# EAGLE design xyzxyz (EAGLE 9.0.1)
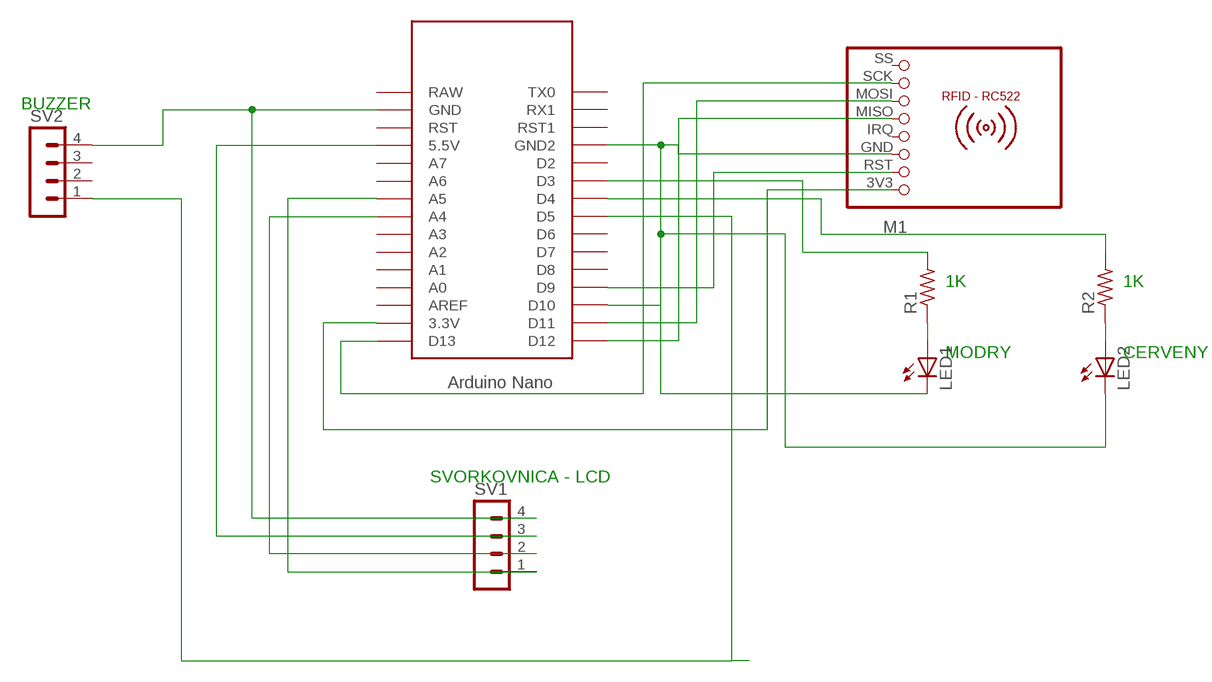
[diagram p0: schematic, sheet 1]

## Parts
LED1  LED3MM  [LED3MM]
LED2  LED3MM  [LED3MM]
M1  RFID-RC522  [RFID-RC522]
R1  R-US_0414/15  [0414/15]
R2  R-US_0414/15  [0414/15]
SV1  MA04-1  [MA04-1]
SV2  MA04-1  [MA04-1]
U$1  NANO  [NANO]

## Nets
N$1: M1.3V3 U$1.3.3V
N$2: LED1.K(C) LED2.K(C) M1.GND U$1.GND1(GND2)
N$3: M1.RST U$1.D9
N$4: M1.MISO U$1.D12
N$5: M1.MOSI U$1.D11
N$6: M1.SCK U$1.D13
N$7: U$1.D10
N$8: SV1.4 SV2.4 U$1.GND
N$9: SV1.3 U$1.5V(5.5V)
N$10: SV1.2 U$1.A4
N$11: SV1.1 U$1.A5
N$13: LED1.A R1.1
N$14: LED2.A R2.1
N$15: R1.2 U$1.D3
N$16: R2.2 U$1.D4
N$18: SV2.1 U$1.D5
Unconnected: M1.IRQ M1.SS SV2.2 SV2.3 U$1.A0 U$1.A1 U$1.A2 U$1.A3 U$1.A6 U$1.A7 U$1.AREF U$1.D2 U$1.D6 U$1.D7 U$1.D8 U$1.ICSP1 U$1.ICSP2 U$1.ICSP3 U$1.ICSP4 U$1.ICSP5 U$1.ICSP6 U$1.RAW U$1.RST U$1.RST1 U$1.RX1 U$1.TX0

## Notes on the sheet
- BUZZER
- 1K | 1K
- MODRY | CERVENY
- SVORKOVNICA - LCD

## Library data of the parts
LED1 LED2 = adafruit:LED: LED OSRAM: - CHIPLED LG R971, LG N971, LY N971, LG Q971, LY Q971, LO R971, LY R971 LH N974, LH R974 LS Q976, LO Q976, LY Q976 LO Q996 - Hyper CHIPLED LW Q18S LB Q993, LB Q99A, LB R99A - SideLED LS A670, LO A670, LY A670, LG A670, LP A670 LB A673, LV A673, LT A673, LW A673 LH A674 LY A675 LS A676, LA A676, LO A676, LY A676, LW A676 LS A679, LY A679, LG A679 - Hyper Micro SIDELED® LS Y876, LA Y876, LO Y876, LY Y876 LT Y87S - SmartLED LW L88C, LW L88S LB L89C, LB L89S, LG L890 LS L89K, LO L89K, LY L89K LS L896, LA L896, LO L896, LY L896 - TOPLED LS T670, LO T670, LY T670, LG T670, LP T670 LSG T670, LSP T670, LSY T670, LOP T670, LYG T670 LG T671, LOG T671, LSG T671 LB T673, LV T673, LT T673, LW T673 LH T674 LS T676, LA T676, LO T676, LY T676, LB T676, LH T676, LSB T676, LW T676 LB T67C, LV T67C, LT T67C, LS T67K, LO T67K, LY T67K, LW E67C LS E67B, LA E67B, LO E67B, LY E67B, LB E67C, LV E67C, LT E67C LW T67C LS T679, LY T679, LG T679 LS T770, LO T770, LY T770, LG T770, LP T770 LB T773, LV T773, LT T773, LW T773 LH T774 LS E675, LA E675, LY E675, LS T675 LS T776, LA T776, LO T776, LY T776, LB T776 LHGB T686 LT T68C, LB T68C - Hyper Mini TOPLED® LB M676 - Mini TOPLED Santana® LG M470 LS M47K, LO M47K, LY M47K Source: http://www.osram.convergy.de/
M1 = mfrc522-module:RFID-RC522: RFID-RC522 MFRC-522 based breakout board
R1 R2 = adafruit:R-US_: RESISTOR, American symbol
SV1 SV2 = con-lstb:MA04-1: PIN HEADER; OC_FARNELL: unknown; OC_NEWARK: unknown
U$1 = Arduino-clone:NANO: Arduino Nano

## Board
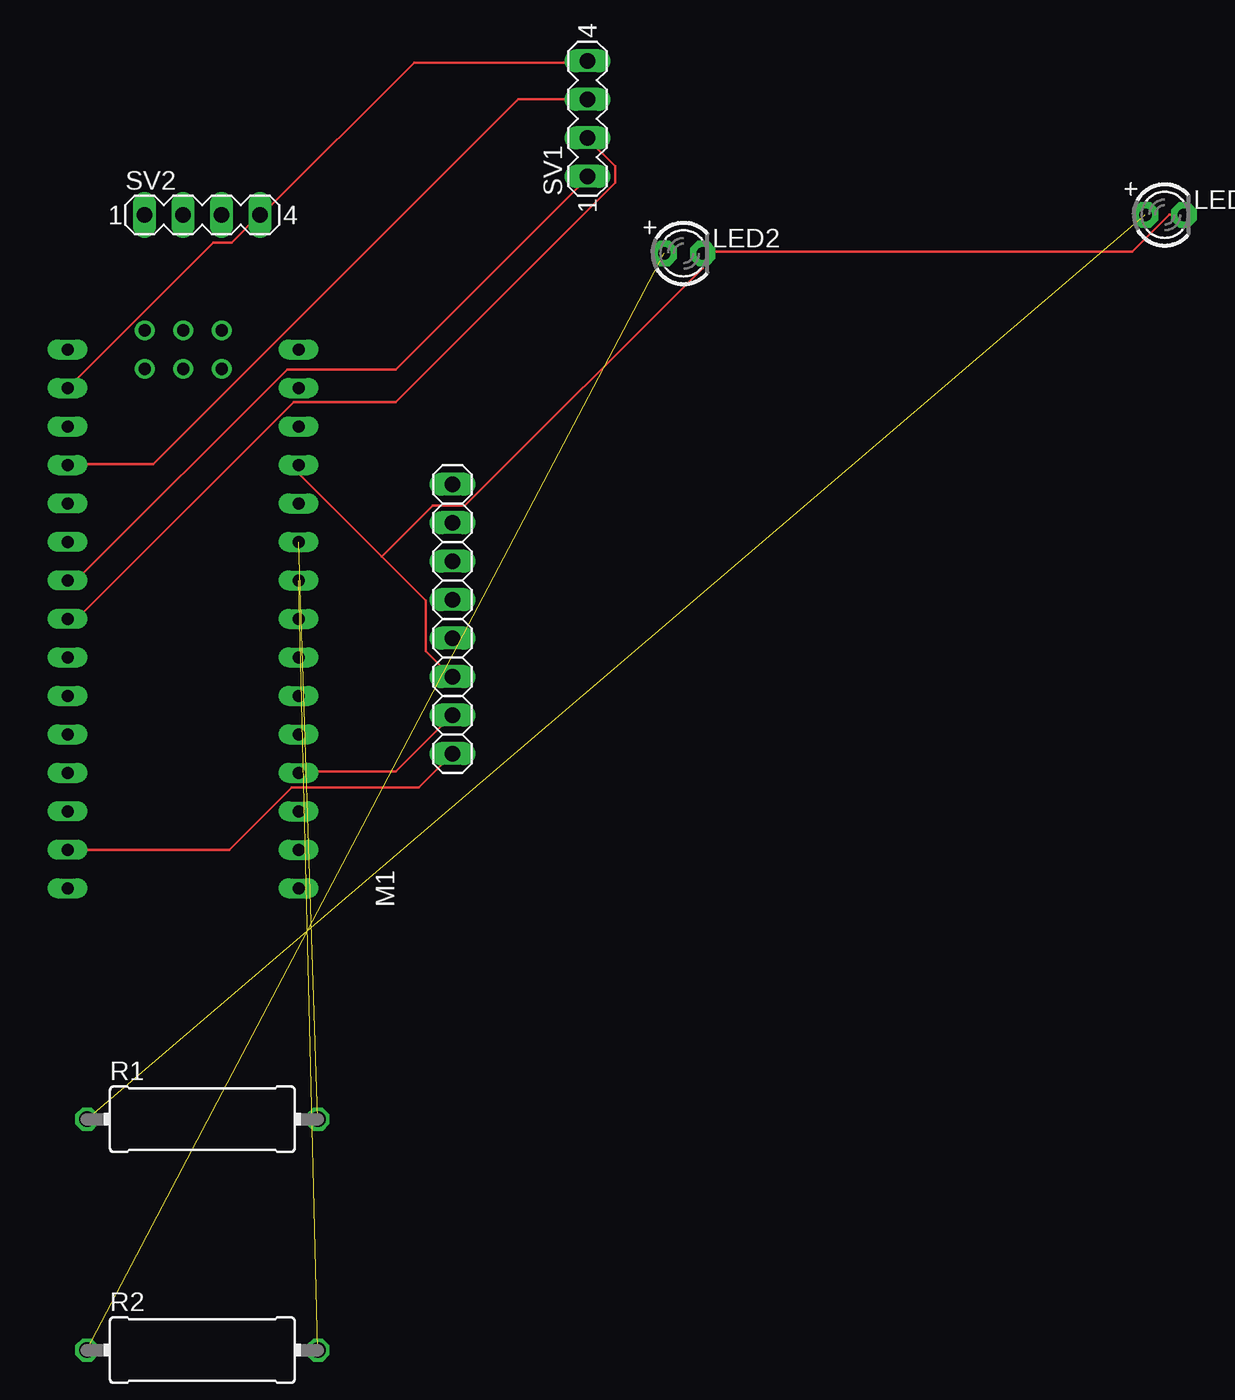
[diagram p1: board, top side]
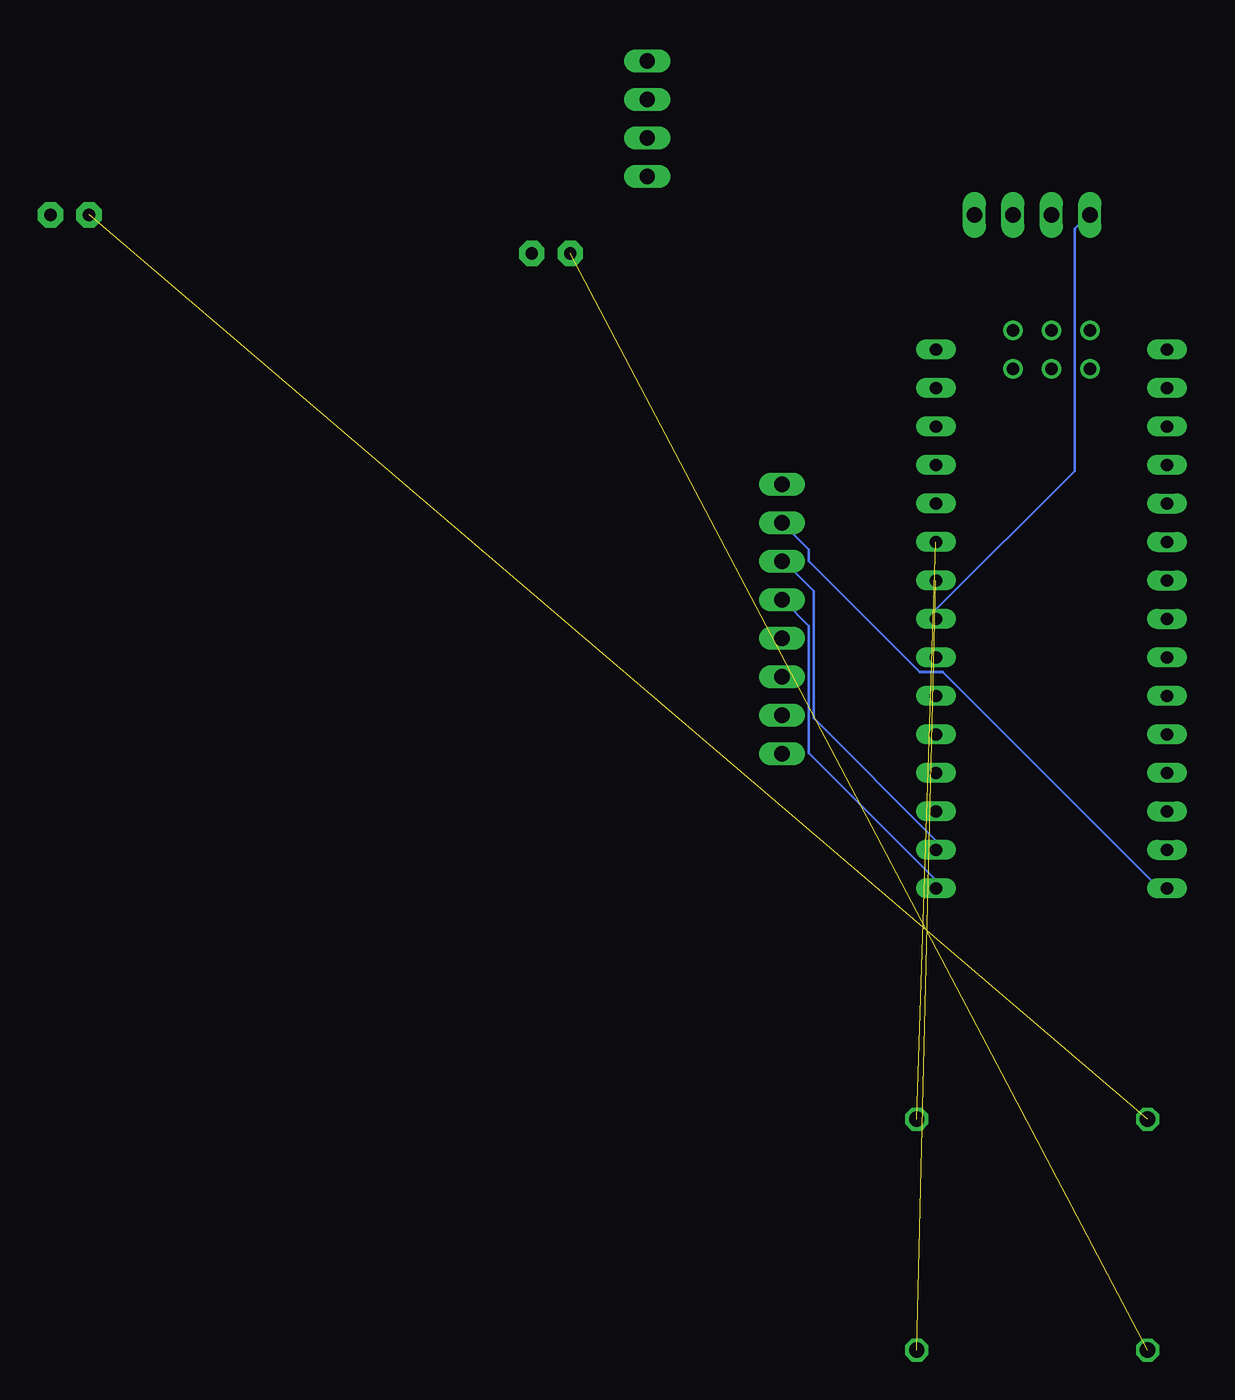
[diagram p2: board, bottom side, seen from below]

No outline drawn. Coordinates in mm, seen from the top.
Copper layers (1*16): Top 0.035mm / dielectric 1.5mm / Bottom 0.035mm
Design rules "default": minimum track width 6mil, minimum drill 0.35mm, track to track 6mil, track to pad 6mil, pad to pad 6mil, via to via 6mil, smd to smd 6mil, copper to edge 40mil, drill to drill 6mil, minimum pad ring 10mil, minimum via ring 8mil, stop-mask expansion 4mil, vias tented up to drill 0mil, thermal gap 10mil

### Footprints (pad centres in the part's own frame; a part is rotated, then mirrored left to right if it is on the bottom)
LED3MM = drill 0.813 pad 1.676 octagon: A -1.27,0; K 1.27,0
RFID-RC522 = drill 1.016 long: 3V3 -8.89,0; GND -3.81,0; IRQ -1.27,0; MISO 1.27,0; MOSI 3.81,0; RST -6.35,0; SCK 6.35,0; SS 8.89,0
0414/15 = drill 1.016 octagon: 1 -7.62,0; 2 7.62,0
MA04-1 = drill 1.016 long: 1 -3.81,0; 2 -1.27,0; 3 1.27,0; 4 3.81,0
NANO = drill 0.8 long: 3.3V -10.16,24.13; 5V -10.16,-1.27; A0 -10.16,19.05; A1 -10.16,16.51; A2 -10.16,13.97; A3 -10.16,11.43; A4 -10.16,8.89; A5 -10.16,6.35; A6 -10.16,3.81; A7 -10.16,1.27; AREF -10.16,21.59; D2 5.08,1.27; D3 5.08,3.81; D4 5.08,6.35; D5 5.08,8.89; D6 5.08,11.43; D7 5.08,13.97; D8 5.08,16.51; D9 5.08,19.05; D10 5.08,21.59; D11 5.08,24.13; D12 5.08,26.67; D13 -10.16,26.67; GND -10.16,-6.35; GND1 5.08,-1.27; RAW -10.16,-8.89; RST -10.16,-3.81; RST1 5.08,-3.81; RX1 5.08,-6.35; TX0 5.08,-8.89 | drill 0.8: ICSP1 -5.08,-10.16; ICSP2 -5.08,-7.62; ICSP3 -2.54,-10.16; ICSP4 -2.54,-7.62; ICSP5 0,-10.16; ICSP6 0,-7.62

### Placement (x,y rotation side)
LED1  76.2,49.53 0 top
LED2  44.45,46.99 0 top
M1  29.21,22.86 90 top
R1  12.7,-10.16 0 top
R2  12.7,-25.4 0 top
SV1  38.1,55.88 90 top
SV2  12.7,49.53 0 top
U$1  13.97,31.75 180 bottom

### Tracks (layer width: path | path; a pad name or v marks a point on that pad's centre or on a via)
N$1
  Top 0.152: U$1.3.3V 14.48,7.62 18.59,11.73 26.98,11.73 M1.3V3
N$2
  Top 0.152: U$1.GND1 19.05,32.46 24.54,26.98 | 24.54,26.98 27.43,24.08 27.43,20.73 29.11,19.05 M1.GND | 24.54,26.98 27.89,30.33 30.02,30.33 45.72,46.02 LED2.K 45.72,47.09 74.07,47.09 76.5,49.53 LED1.K
N$3
  Top 0.152: U$1.D9 19.05,12.8 25.45,12.8 29.11,16.46 M1.RST
N$4
  Bottom 0.152: U$1.D12 19.05,5.64 27.43,14.02 27.43,22.4 29.11,24.08 M1.MISO
N$5
  Bottom 0.152: U$1.D11 19.05,8.23 27.13,16.31 27.13,24.69 29.11,26.67 M1.MOSI
N$6
  Bottom 0.152: M1.SCK 27.43,27.43 27.43,26.67 20.12,19.36 18.59,19.36 4.42,5.18 3.81,5.18 U$1.D13
N$8
  Top 0.152: U$1.GND 13.41,47.7 14.63,47.7 16.46,49.53 SV2.4 16.61,49.53 26.67,59.59 38.1,59.59 SV1.4
N$9
  Top 0.152: SV1.3 33.53,57.15 9.45,33.07 3.81,33.07 U$1.5V
N$10
  Top 0.152: U$1.A4 4.42,22.86 18.75,37.19 25.45,37.19 39.93,51.66 39.93,52.73 38.1,54.56 SV1.2
N$11
  Top 0.152: U$1.A5 3.81,25.45 4.42,25.45 18.29,39.32 25.45,39.32 38.1,51.97 SV1.1
N$13  (1 unrouted)
N$14  (1 unrouted)
N$15  (1 unrouted)
N$16  (1 unrouted)
N$18
  Bottom 0.152: U$1.D5 19.05,23.47 9.91,32.61 9.91,48.62 8.99,49.53 SV2.1